# EAGLE schematic WCRL_Board_V2 (EAGLE 9.6.2)
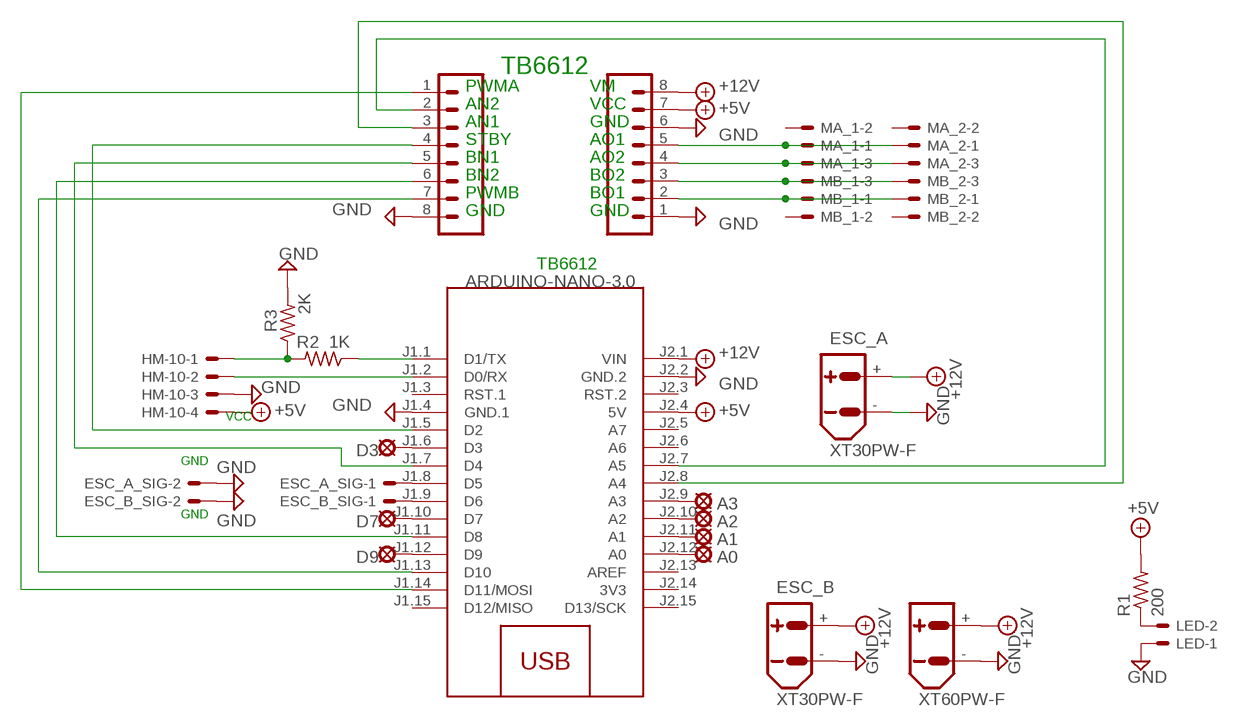
[diagram p0: schematic, sheet 1]

## Parts
A0  LSP10  [LSP10]
A1  LSP10  [LSP10]
A2  LSP10  [LSP10]
A3  LSP10  [LSP10]
BATTERY  XT60PW-F  [XT60PW-F]
D3  LSP10  [LSP10]
D7  LSP10  [LSP10]
D9  LSP10  [LSP10]
ESC_A  XT30PW-F  [XT30PW-F]
ESC_A_SIG  JST-XH-02-PIN-LONG-PAD  [JST-XH-02-PACKAGE-LONG-PAD]
ESC_B  XT30PW-F  [XT30PW-F]
ESC_B_SIG  JST-XH-02-PIN-LONG-PAD  [JST-XH-02-PACKAGE-LONG-PAD]
HM-10  JST-XH-04-PIN-LONG-PAD  [JST-XH-04-PACKAGE-LONG-PAD]
J1  CONN_08NO_SILK_FEMALE_PTH  [1X08_NO_SILK]
J2  CONN_08NO_SILK_FEMALE_PTH  [1X08_NO_SILK]
LED  JST-XH-02-PIN-LONG-PAD  [JST-XH-02-PACKAGE-LONG-PAD]
M1  ARDUINO-NANO-3.0  [ARDUINO-NANO-3.0]
MA_1  JST-XH-03-PIN-LONG-PAD  [JST-XH-03-PACKAGE-LONG-PAD]
MA_2  JST-XH-03-PIN-LONG-PAD  [JST-XH-03-PACKAGE-LONG-PAD]
MB_1  JST-XH-03-PIN-LONG-PAD  [JST-XH-03-PACKAGE-LONG-PAD]
MB_2  JST-XH-03-PIN-LONG-PAD  [JST-XH-03-PACKAGE-LONG-PAD]
R1  200  R-US_0204/5  [0204/5]
R2  1K  R-US_0204/5  [0204/5]
R3  2K  R-US_0204/5  [0204/5]

## Nets
+5V: HM-10.4 J1.7 M1.J2.4(5V) R1.2
+12V: BATTERY.+ ESC_A.+ ESC_B.+ J1.8 M1.J2.1(VIN)
GND: BATTERY.- ESC_A.- ESC_A_SIG.2 ESC_B.- ESC_B_SIG.2 HM-10.3 J1.1 J1.6 J2.8 LED.1 M1.J1.4(GND.1) M1.J2.2(GND.2) R3.2
N$1: D3.MP M1.J1.6(D3)
N$2: D7.MP M1.J1.10(D7)
N$3: D9.MP M1.J1.12(D9)
N$4: HM-10.1 R2.2 R3.1
N$5: ESC_A_SIG.1 M1.J1.8(D5)
N$6: ESC_B_SIG.1 M1.J1.9(D6)
N$7: M1.J1.1(D1/TX) R2.1
N$8: J2.4 M1.J1.5(D2)
N$9: J2.3 M1.J2.8(A4)
N$10: J1.5 MA_1.1 MA_2.1
N$11: J1.4 MA_1.3 MA_2.3
N$12: J1.2 MB_1.1 MB_2.1
N$13: J1.3 MB_1.3 MB_2.3
N$14: HM-10.2 M1.J1.2(D0/RX)
N$15: J2.2 M1.J2.7(A5)
N$16: J2.5 M1.J1.7(D4)
N$17: J2.6 M1.J1.11(D8)
N$18: LED.2 R1.1
N$20: J2.7 M1.J1.13(D10)
N$21: J2.1 M1.J1.14(D11/MOSI)
N$24: A3.MP M1.J2.9(A3)
N$25: A1.MP M1.J2.11(A1)
N$27: A0.MP M1.J2.12(A0)
N$28: A2.MP M1.J2.10(A2)
Unconnected: M1.J1.3(RST.1) M1.J1.15(D12/MISO) M1.J2.3(RST.2) M1.J2.5(A7) M1.J2.6(A6) M1.J2.13(AREF) M1.J2.15(D13/SCK) MA_1.2 MA_2.2 MB_1.2 MB_2.2

## Notes on the sheet
- TB6612
- PWMA | VM
- AN2 | VCC
- AN1 | GND
- STBY | AO1
- BN1 | AO2
- BN2 | BO2
- PWMB | BO1
- GND | GND
- TB6612
- VCC
- GND
- GND

## Power pins joined to a net without a drawn wire
3V3: M1.J2.14(3V3)

## Library data of the parts
A0 A1-A3 D3 D7 D9 = solpad:LSP10: SOLDER PAD drill 1.0 mm, distributor Buerklin, 12H555
BATTERY = xt30:XT60: AMASS XT60 connector Store in Japan AMASS XT60 connector <https://szc.jp/ams-xt60>
ESC_A ESC_B = xt30:XT30: AMASS XT30 connector Store in Japan AMASS XT30 connector <https://szc.jp/ams-xt30>
ESC_A_SIG ESC_B_SIG LED = Rembrandt Electronics - JST XH Connectors v1-0:JST-XH-02-PIN: JST XH Connector 2 Pin Wire to board connector. Pitch: 2,54 mm, (0.100") Number of pins: 2 Created by Rembrandt Electronics www.rembrandtelectronics.com
HM-10 = Rembrandt Electronics - JST XH Connectors v1-0:JST-XH-04-PIN: JST XH Connector 2 Pin Wire to board connector. Pitch: 2,54 mm, (0.100") Number of pins: 4 Created by Rembrandt Electronics www.rembrandtelectronics.com
J1 J2 = SparkFun-Connectors:CONN_08: Multi connection point. Often used as Generic Header-pin footprint for 0.1 inch spaced/style header connections On any of the 0.1 inch spaced packages, you can populate with these: Break Away Headers - Straight <https://www.sparkfun.com/products/116> (PRT-00116) Break Away Male Headers - Right Angle <https://www.sparkfun.com/products/553> (PRT-00553) Female Headers <https://www.sparkfun.com/products/115> (PRT-00115) Break Away Headers - Machine Pin <https://www.sparkfun.com/products/117> (PRT-00117) Break Away Female Headers - Swiss Machine Pin <https://www.sparkfun.com/products/743> (PRT-00743) Arduino Stackable Header - 8 Pin <https://www.sparkfun.com/products/9279> (PRT-09279) For SCREWTERMINALS and SPRING TERMINALS visit here: Screw Terimnals on SparkFun.com <https://www.sparkfun.com/search/results?term=Screw+Terminals> (5mm/3.5mm/2.54mm spacing) This device is also useful as a general connection point to wire up your design to another part of your project. Our various solder wires solder well into these plated through hole pads. Hook-Up Wire - Assortment (Stranded, 22 AWG) <https://www.sparkfun.com/products/11375> (PRT-11375) Hook-Up Wire - Assortment (Solid Core, 22 AWG) <https://www.sparkfun.com/products/11367> (PRT-11367) View the entire wire category on our website here <https://www.sparkfun.com/categories/141> Special notes: Molex polarized connector foot print use with SKU : PRT-08231 with associated crimp pins and housings. 1MM SMD Version SKU: PRT-10208 NOTES ON THE VARIANTS LOCK and LOCK_LONGPADS... This footprint was designed to help hold the alignment of a through-hole component (i.e. 6-pin header) while soldering it into place. You may notice that each hole has been shifted either up or down by 0.005 of an inch from it's more standard position (which is a perfectly straight line). This slight alteration caused the pins (the squares in the middle) to touch the edges of the holes. Because they are alternating, it causes a "brace" to hold the component in place. 0.005 has proven to be the perfect amount of "off-center" position when using our standard breakaway headers. Although looks a little odd when you look at the bare footprint, once you have a header in there, the alteration is very hard to notice. Also,if you push a header all the way into place, it is covered up entirely on the bottom side.; PROD_ID: CONN-08438
M1 = diy-modules:ARDUINO-NANO-3.0: Arduino Nano 3.0 and compatible devices More details available here: https://www.arduino.cc/en/Main/ArduinoBoardNano Click here to find device on ebay.com <http://www.ebay.com/sch/arduino+nano>
MA_1 MA_2 MB_1 MB_2 = Rembrandt Electronics - JST XH Connectors v1-0:JST-XH-03-PIN: JST XH Connector 2 Pin Wire to board connector. Pitch: 2,54 mm, (0.100") Number of pins: 3 Created by Rembrandt Electronics www.rembrandtelectronics.com
R1-R3 = BeagleBone_Black_Wireless:R-US_: RESISTOR, American symbol